# Altium schematic sheet EDRMY.SchDoc
size B; SheetNumber: 2; SheetTotal: 1
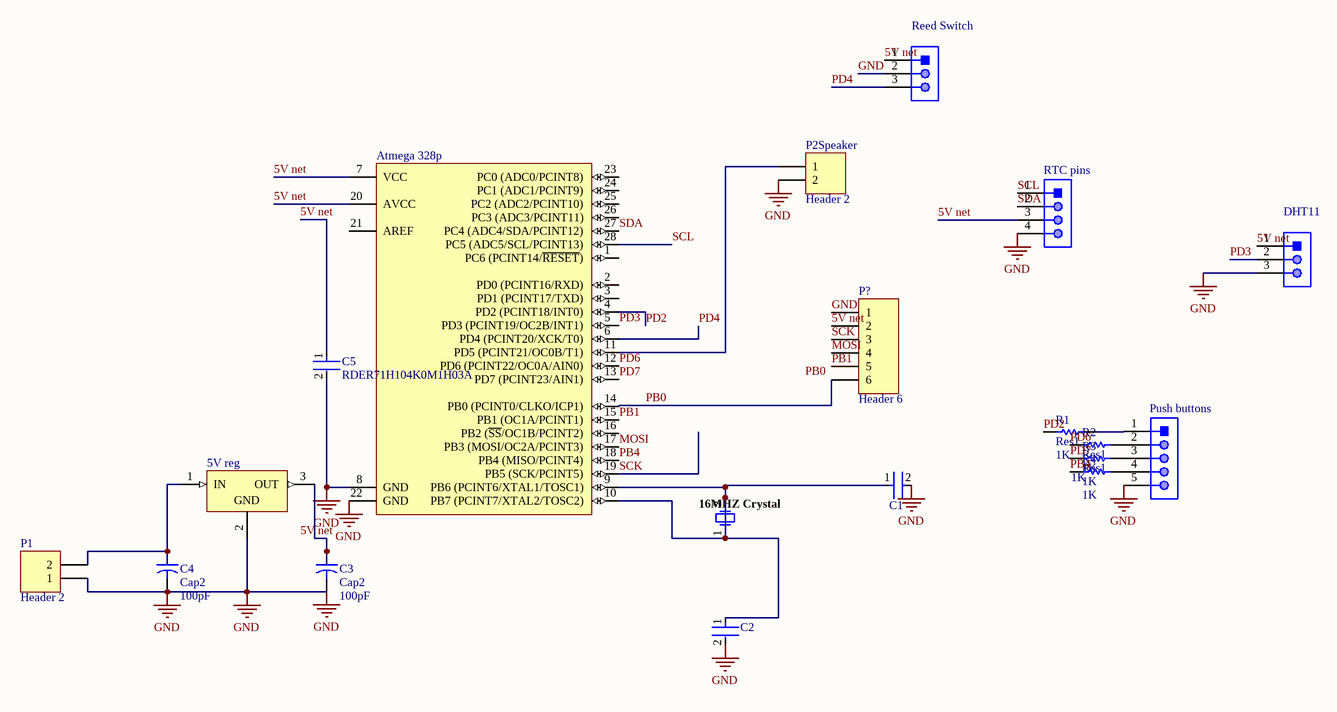
[diagram p0: EDRMY.SchDoc]

## Parts
5V_reg  LM7805CT  [FAIR-TO-220-3]  (value not drawn)
16MHZ_Crystal  FOXSLF/160-20  [FOX-FOXSLF160-20]  (value not drawn)
Atmega_328p  ATmega328-PU  [28P3]  (value not drawn)
C1  RCE5C1H220J0K1H03B  [FP-RCE0K1-MFG]  (value not drawn)
C2  RCE5C1H220J0K1H03B  [FP-RCE0K1-MFG]  (value not drawn)
C3  Cap2  value 100pF  [CAPR5-4X5]
C4  Cap2  value 100pF  [CAPR5-4X5]
C5  RDER71H104K0M1H03A  [FP-RDE0M1-MFG]
DHT11  61300311121  [61300311121]  (value not drawn)
P1  Header 2  [HDR1X2]
P2Speaker  Header 2  [HDR1X2]
P?  Header 6  [HDR1X6]
Push_buttons  61300511121  [61300511121]  (value not drawn)
R1  Res1  value 1K  [AXIAL-0.3]
R2  Res1  value 1K  [AXIAL-0.3]
R3  Res1  value 1K  [AXIAL-0.3]
R4  1K  [AXIAL-0.3]
Reed_Switch  61300311121  [61300311121]  (value not drawn)
RTC_pins  61300411121  [61300411121]  (value not drawn)

## Nets
GND: 5V_reg.2(GND) Atmega_328p.8(GND) Atmega_328p.22(GND) C1.2 C2.2 C3.2 C4.2 C5.2 DHT11.3 P1.1 P2Speaker.2 P?.1 Push_buttons.5 Reed_Switch.2 RTC_pins.4
5V net: Atmega_328p.7(VCC) Atmega_328p.20(AVCC) C5.1 DHT11.1 P?.2 Reed_Switch.1 RTC_pins.3
MOSI: Atmega_328p.17(PB3_(MOSI/OC2A/PCINT3)) P?.4
PB0: Atmega_328p.14(PB0_(PCINT0/CLKO/ICP1)) P?.6
PB1: Atmega_328p.15(PB1_(OC1A/PCINT1)) P?.5
PB4: Atmega_328p.18(PB4_(MISO/PCINT4)) R4.1
PD2: Atmega_328p.4(PD2_(PCINT18/INT0)) R1.1
PD3: Atmega_328p.5(PD3_(PCINT19/OC2B/INT1)) DHT11.2
PD4: Atmega_328p.6(PD4_(PCINT20/XCK/T0)) Reed_Switch.3
PD6: Atmega_328p.12(PD6_(PCINT22/OC0A/AIN0)) R2.1
PD7: Atmega_328p.13(PD7_(PCINT23/AIN1)) R3.1
SCK: Atmega_328p.19(PB5_(SCK/PCINT5)) P?.3
SCL: Atmega_328p.28(PC5_(ADC5/SCL/PCINT13)) RTC_pins.1
SDA: Atmega_328p.27(PC4_(ADC4/SDA/PCINT12)) RTC_pins.2
Net5V_reg_1: 5V_reg.1(IN) C4.1 P1.2
Net5V_reg_3: 5V_reg.3(OUT) C3.1
Net16MHZ_Crystal_1: 16MHZ_Crystal.1 16MHZ_Crystal.2 Atmega_328p.9(PB6_(PCINT6/XTAL1/TOSC1)) Atmega_328p.10(PB7_(PCINT7/XTAL2/TOSC2)) C1.1 C2.1
NetAtmega_328p_11: Atmega_328p.11(PD5_(PCINT21/OC0B/T1)) P2Speaker.1
NetPush_buttons_1: Push_buttons.1 R1.2
NetPush_buttons_2: Push_buttons.2 R2.2
NetPush_buttons_3: Push_buttons.3 R3.2
NetPush_buttons_4: Push_buttons.4 R4.2

Not connected (* = marked no-connect by the designer): Atmega_328p 1(PC6_(PCINT14/~{RESET})) 2(PD0_(PCINT16/RXD)) 3(PD1_(PCINT17/TXD)) 16(PB2_(~{SS}/OC1B/PCINT2)) 21(AREF) 23(PC0_(ADC0/PCINT8)) 24(PC1_(ADC1/PCINT9)) 25(PC2_(ADC2/PCINT10)) 26(PC3_(ADC3/PCINT11))

## Notes on the sheet
- Labels drawn without touching a wire or pin: 5V net, PB0

## Library data of the parts
5V_reg = CMP-2000-04938-1: Positive Voltage Regulator, 5 V, 1 A, -40 to 125 degC, 3-Pin TO-220, RoHS, Tube; Manufacturer: FairchildSemiconductor; Maximum Input Voltage: 35V; Maximum Quiescent Current: 8mA; Load Regulation: 100mV; Maximum Output Current: 2.2(Typ)A; Output Type: Fixed; Typical Dropout Voltage @ Current: 2@1AV; Rad Hard: No; Output Voltage: 5V; Accuracy: ±4%; Number of Outputs: 1; Category: LinearRegulator; Package Description: 3-Pin Through Hole Device, Body 10 x 4.5 mm, Pitch 2.54 mm; Packaging: Rail/Tube; Mounting: ThroughHole; Polarity: Positive; Manufacturer URL: https://www.fairchildsemi.com/; Line Regulation: 100mV; Datasheet Version: Aug-12; Datasheet URL: https://datasheet.ciiva.com/26904/lm7805ct-26904988.pdf; Package Reference: TO-220; Package URL: https://www.fairchildsemi.com/package-drawings/TO/TO220B03.pdf; Package: 3TO-220AB; Operating Temperature: -40to125degC; Type: Linear
16MHZ_Crystal = CMP-1749-00003-1: Resistance Weld Thru-Hole Crystal, 16 MHz, -20 to 70 degC, 2-Pin THD, RoHS, Bulk; Voltage Rating: 250 V; Tolerance: 1%; Resistance: 221 kohm; Case\Package: Axial; Power Rating: 250 mW; RoHSCompliant: true; Package Quantity: 200; Packaging: Bulk; Min Operating Temperature: -55 degC; DatasheetVersion: Mar-15; ComponentLink1URL: http://www.foxonline.com/; Max Operating Temperature: 155 degC; PackageReference: FOXSLF160-20; Mount: Through Hole; PackageDescription: 2-Pin Through Hole Device, Body 11.35 x 4.65 mm; ComponentLink1Description: Manufacturer URL; ComponentLink2URL: http://www.foxonline.com/pdfs/hc49slf.pdf; ComponentLink2Description: Datasheet; Length: 0.248 inch
Atmega_328p = CMP-0095-00015-2: 8-bit AVR Microcontroller, 32KB Flash, 1KB EEPROM, 2KB SRAM, 28-pin PDIP, Industrial Grade (-40°C to 85°C); ComponentLink3Description: ATmega48A/48PA/88A/88PA/168A/168PA/328/328P Summary; RevisionNote: DatasheetVersion updated. URLs added.; DatasheetVersion: revD, May-2011; ComponentLink1URL: http://www.atmel.com/; PackageVersion: revB, Sep-2001; PackageDescription: 28-lead (0.300"/7.62mm Wide) Plastic Dual Inline Package (PDIP); PackageReference: 28P3; ComponentLink1Description: Manufacturer URL; ComponentLink2Description: ATmega48A/48PA/88A/88PA/168A/168PA/328/328P Datasheet; ComponentLink3URL: http://www.atmel.com/dyn/resources/prod_documents/8271S.pdf; ComponentLink2URL: http://www.atmel.com/dyn/resources/prod_documents/8271.pdf
C1 C2 = CMP-06035-047580-1: Cap Ceramic 22pF 50V C0G ±5% Radial 5mm +125°C Automotive Bulk; Lead/Base Style: Formed Leads; Lead Diameter: 0.5mm; Tolerance: 5%; Dielectric: C0G; Case/Package: Radial; Min Operating Temperature: -55°C; Height: 3.5mm; Length: 0.142inch; Height - Seated (Max): 0.138inch; Lead Pitch: 0.197inch; Resistor Type: Ceramic; Max Operating Temperature: 125°C; Package Quantity: 500; Capacitance: 22pF; Mount: Through Hole; Ratings: AEC-Q200; Termination: Radial; Voltage Rating: 50V; Width: 0.098inch; Voltage Rating (DC): 50V; Packaging: Bulk
C3 C4 = Cap2: Capacitor; Published: 23-Sep-2002; PackageReference: CAPR5-4X5; Publisher: Altium Limited; PackageDescription: Capacitor; 2 Leads
C5 = CMP-06035-051680-1: Ceramic Capacitor 100nF ±10% 50V X7R Radial; Lead/Base Style: Kinked; Lead Diameter: 0.5mm; Lead Free: Lead Free; Mount: Through Hole; Package Quantity: 2000; Lead Pitch: 0.197inch; Capacitance: 100nF; Case/Package: Radial; Tolerance: 10%; Height - Seated (Max): 0.236inch; Max Operating Temperature: 125°C; Dielectric: X7R; Min Operating Temperature: -55°C; Voltage Rating (DC): 50V; Voltage Rating: 50V; Termination: Radial; Height: 3.5mm; Resistor Type: Ceramic; Width: 3.5mm; Packaging: Tape and Reel; Length: 0.157inch
DHT11 Reed_Switch = CMP-1502-01062-1: THT Vertical Pin Header WR-PHD, Pitch 2.54 mm, Single Row, 3 pins; Manufacturer: Wurth Elektronik; Withstanding Voltage: 500VAC; Working Voltage: 250VAC; Rated Current: 3A; Pitch: 2.54mm; Pin Number: 3; Gender: Male; Contact Resistance: 20mOhm; Package Reference: 61300311121; Manufacturer URL: http://www.we-online.de; Datasheet URL: https://katalog.we-online.de/em/datasheet/6130xx11121.pdf; Operating Temperature: -40to105degC; Part Number: 61300311121; Orientation: Vertical; Packaging: Bag; Row Number: Single; Mounting Technology: THT; Publisher: WurthElektronik
P1 P2Speaker = Header 2: Header, 2-Pin; LatestRevisionDate: 17-Jul-2002; LatestRevisionNote: Re-released for DXP Platform.; Publisher: Altium Limited
P? = Header 6: Header, 6-Pin; LatestRevisionDate: 17-Jul-2002; LatestRevisionNote: Re-released for DXP Platform.; Publisher: Altium Limited
Push_buttons = CMP-1502-01068-1: THT Vertical Pin Header WR-PHD, Pitch 2.54 mm, Single Row, 5 pins; Manufacturer: Wurth Elektronik; Pin Number: 5; Contact Resistance: 20mOhm; Working Voltage: 250VAC; Pitch: 2.54mm; Withstanding Voltage: 500VAC; Rated Current: 3A; Gender: Male; Datasheet URL: https://katalog.we-online.de/em/datasheet/6130xx11121.pdf; Orientation: Vertical; Mounting Technology: THT; Row Number: Single; Package Reference: 61300511121; Publisher: WurthElektronik; Part Number: 61300511121; Packaging: Bag; Manufacturer URL: http://www.we-online.de; Operating Temperature: -40to105degC
R1-R4 = Res1: Resistor; Published: 8-Jun-2000; LatestRevisionDate: 17-Jul-2002; LatestRevisionNote: Re-released for DXP Platform.; PackageReference: AXIAL-0.3; Publisher: Altium Limited; PackageDescription: Axial Device, Thru-Hole; 2 Leads; 0.3 in Pin Spacing
  R4: Value: 1K
RTC_pins = CMP-1502-01064-1: THT Vertical Pin Header WR-PHD, Pitch 2.54 mm, Single Row, 4 pins; Manufacturer: Wurth Elektronik; Withstanding Voltage: 500VAC; Rated Current: 3A; Working Voltage: 250VAC; Pin Number: 4; Gender: Male; Contact Resistance: 20mOhm; Pitch: 2.54mm; Manufacturer URL: http://www.we-online.de; Operating Temperature: -40to105degC; Packaging: Bag; Mounting Technology: THT; Package Reference: 61300411121; Datasheet URL: https://katalog.we-online.de/em/datasheet/6130xx11121.pdf; Publisher: WurthElektronik; Part Number: 61300411121; Row Number: Single; Orientation: Vertical